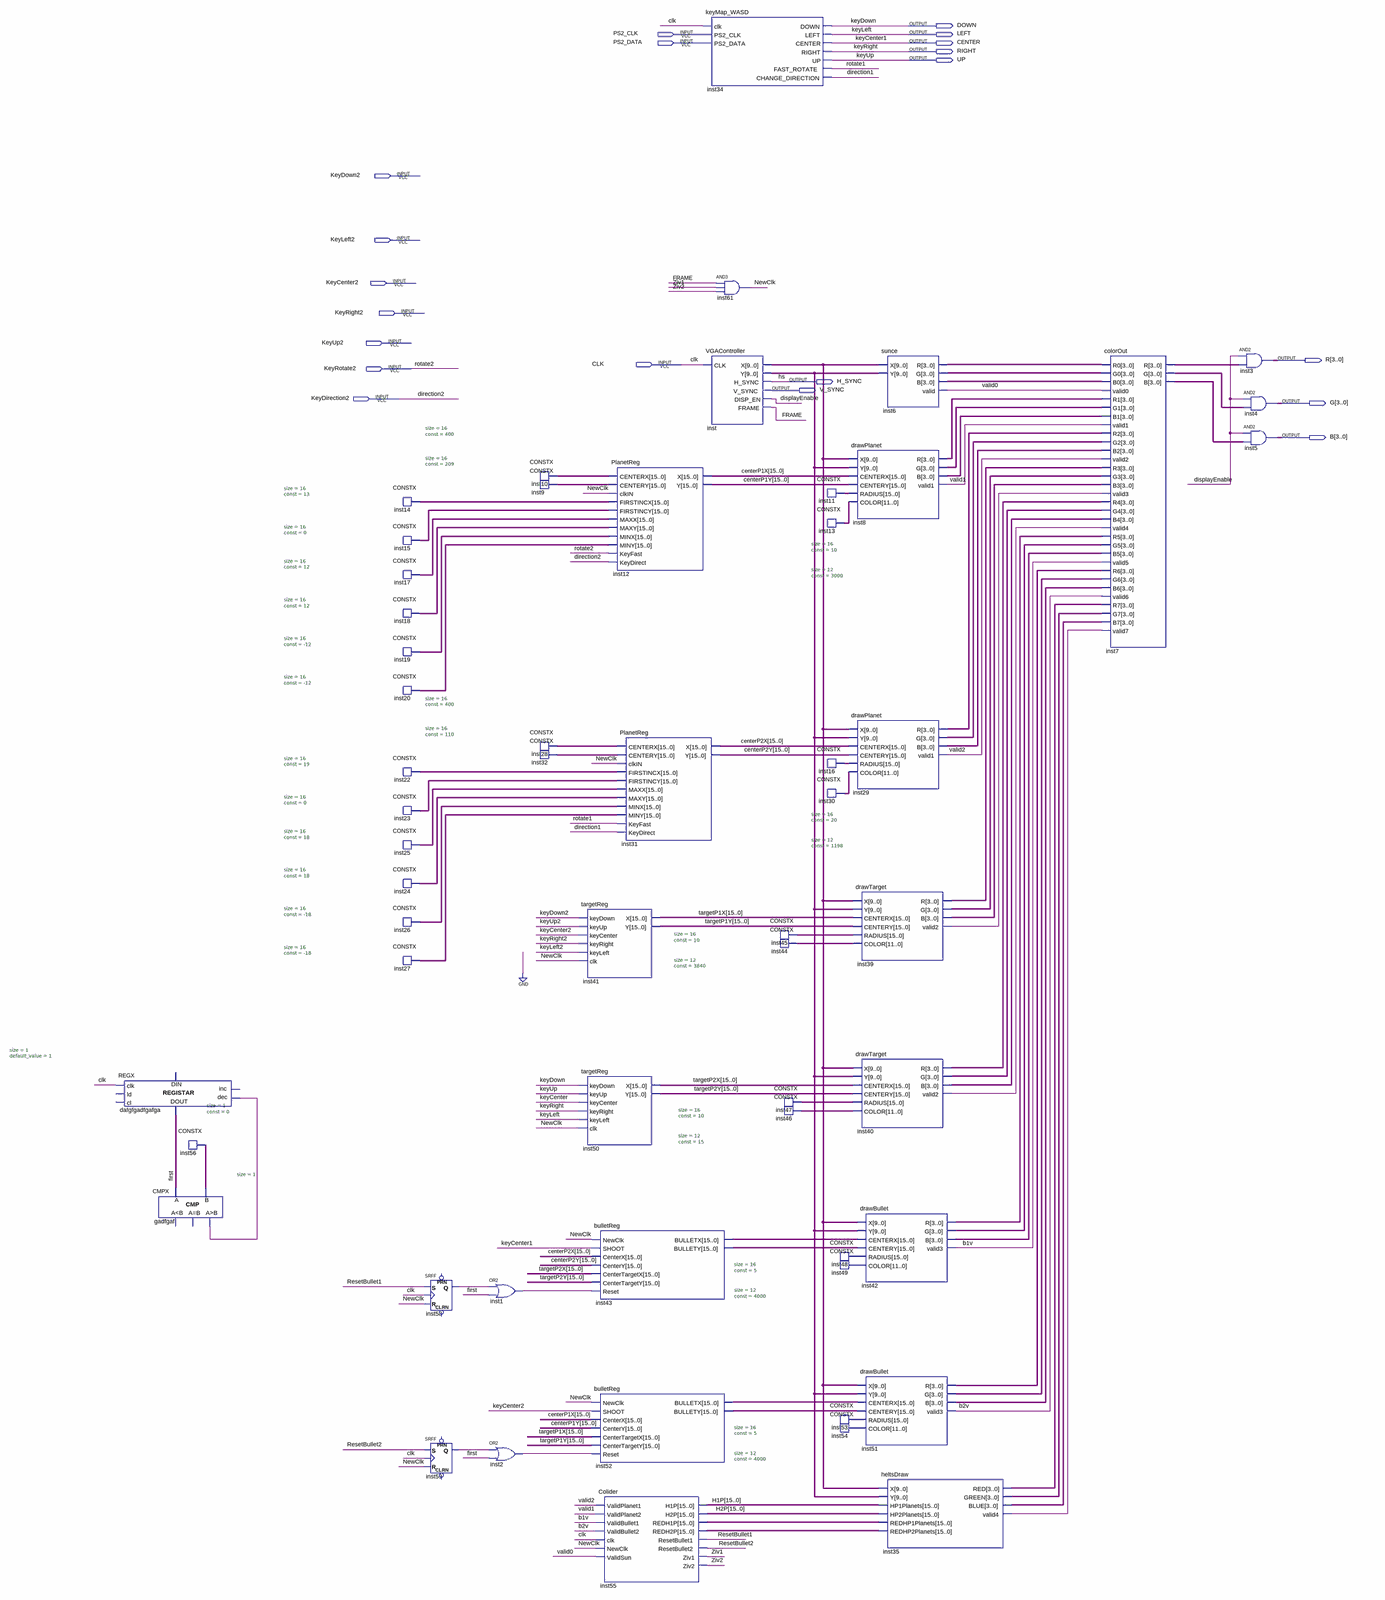
[diagram p0: schematic sheet, whole]
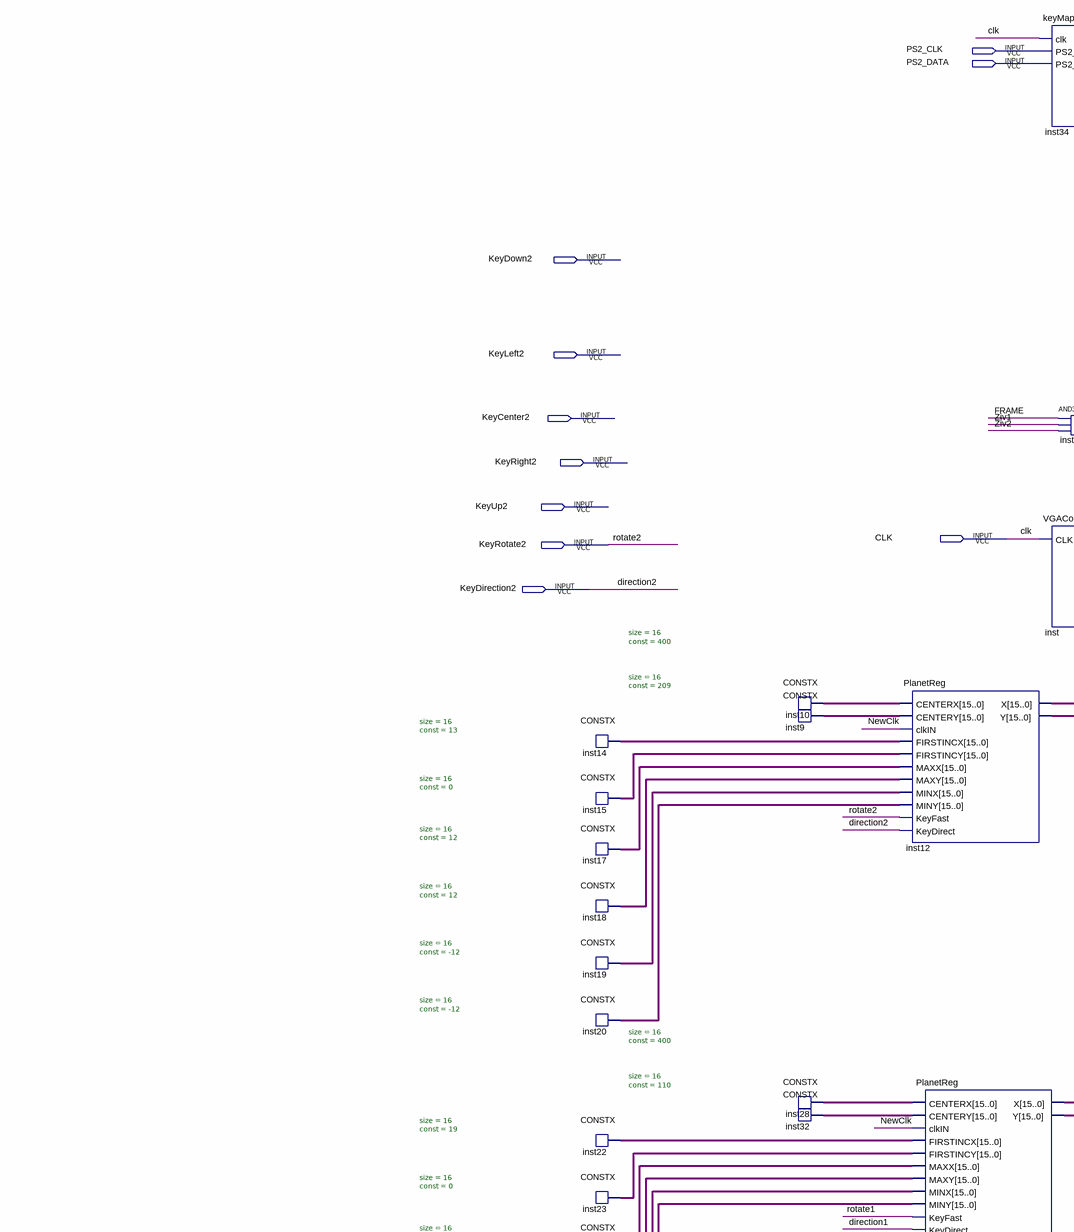
[diagram p1: schematic sheet, upper left part]
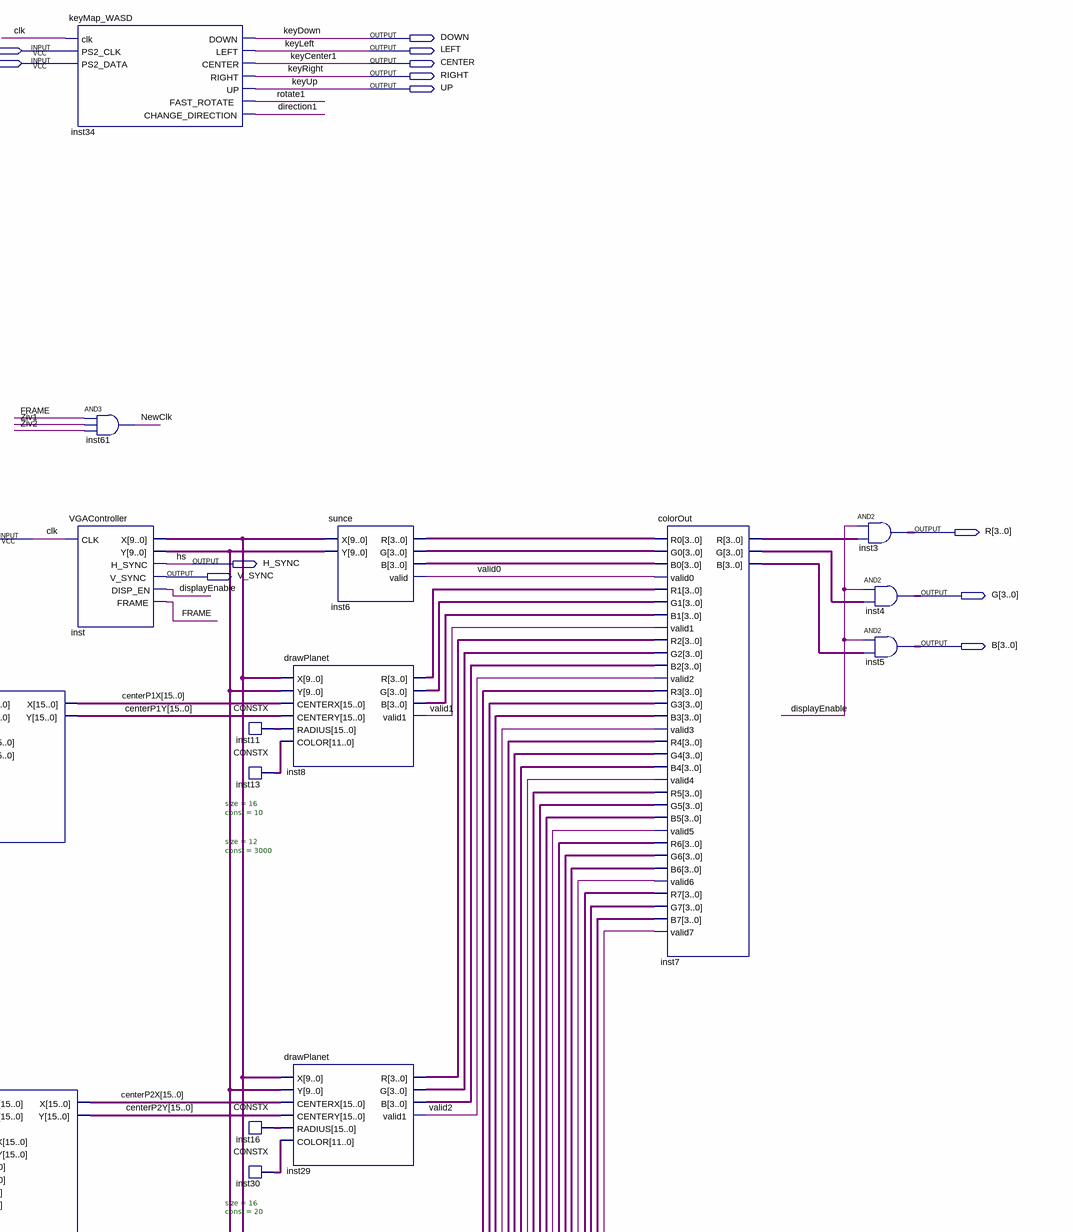
[diagram p2: schematic sheet, upper right part]
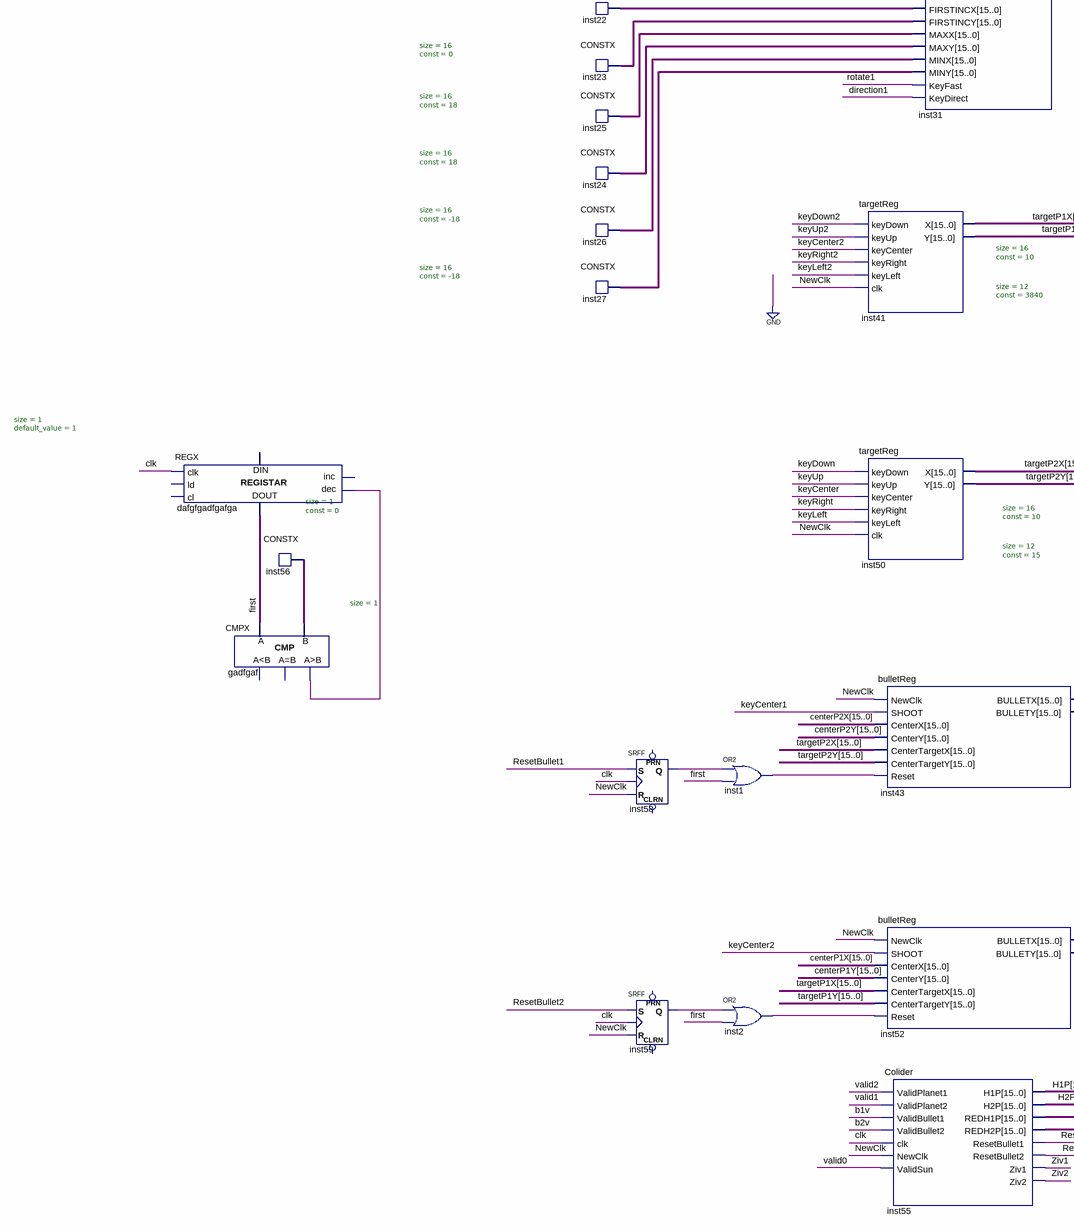
[diagram p3: schematic sheet, lower left part]
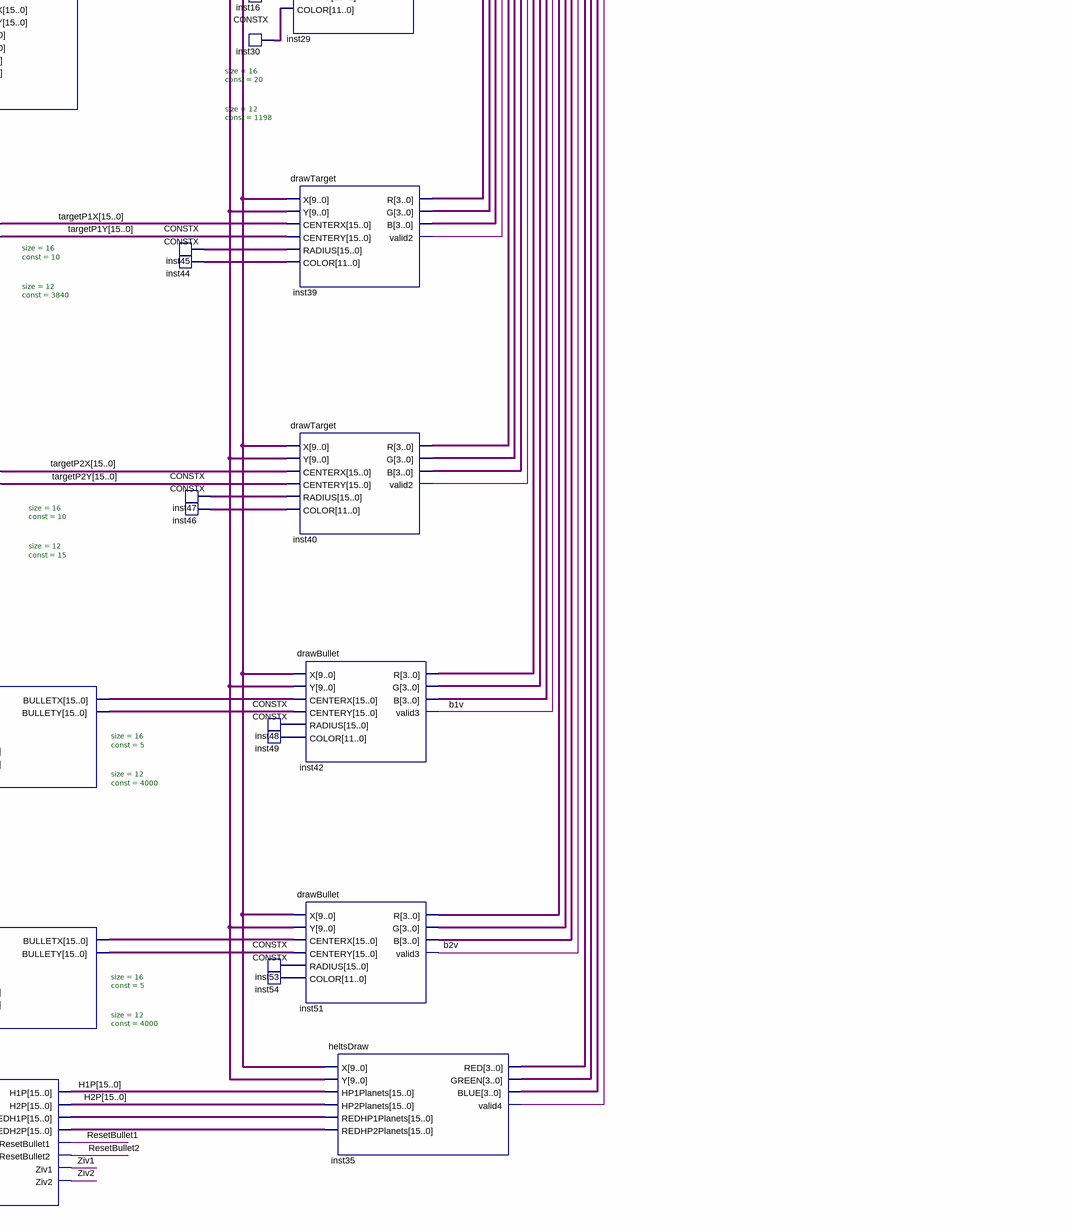
[diagram p4: schematic sheet, lower right part]
// Quartus schematic main.bdf as structural Verilog: 57 symbols, 20 pins
module main (
  input  PS2_CLK,
  input  PS2_DATA,
  input  KeyDown2,
  input  KeyLeft2,
  input  KeyCenter2,
  input  KeyRight2,
  input  KeyUp2,
  input  CLK,
  input  KeyRotate2,
  input  KeyDirection2,
  output DOWN,
  output LEFT,
  output CENTER,
  output RIGHT,
  output UP,
  output [3:0] R,
  output H_SYNC,
  output V_SYNC,
  output [3:0] G,
  output [3:0] B
);

  wire b1v, b2v, direction1, displayEnable, first, FRAME, gadfgaf_gr, inst1_out, inst2_out, inst35_valid4,
       inst39_valid2, inst40_valid2, inst56_data, inst58_q, inst59_q, keyCenter, NewClk, ResetBullet1,
       ResetBullet2, rotate1, valid0, valid1, valid2, Ziv1, Ziv2;
  wire [3:0] inst6_b, inst6_g, inst6_r, inst7_b, inst7_g, inst7_r, inst8_b, inst8_g, inst8_r, inst29_b,
       inst29_g, inst29_r, inst35_blue, inst35_green, inst35_red, inst39_b, inst39_g, inst39_r, inst40_b,
       inst40_g, inst40_r, inst42_b, inst42_g, inst42_r, inst51_b, inst51_g, inst51_r;
  wire [9:0] inst_x, inst_y;
  wire [11:0] inst13_data, inst30_data, inst44_data, inst46_data, inst49_data, inst54_data;
  wire [15:0] centerP1X, centerP1Y, centerP2X, centerP2Y, H1P, H2P, inst9_data, inst10_data, inst11_data,
       inst14_data, inst15_data, inst16_data, inst17_data, inst18_data, inst19_data, inst20_data,
       inst22_data, inst23_data, inst24_data, inst25_data, inst26_data, inst27_data, inst28_data,
       inst32_data, inst43_bulletx, inst43_bullety, inst45_data, inst47_data, inst48_data, inst52_bulletx,
       inst52_bullety, inst53_data, inst55_redh1p, inst55_redh2p, targetP1X, targetP1Y, targetP2X, targetP2Y;

  REGX #(.size(1), .default_value(1)) dafgfgadfgafga (
    .clk(CLK), .dec(gadfgaf_gr), .data_out(first));  // open: ld, cl, inc, data_in
  CMPX #(.size(1)) gadfgaf (.A(first), .B(inst56_data), .gr(gadfgaf_gr));  // open: ls, eq
  CONSTX #(.size(1), .\const (0)) inst56 (.data(inst56_data));
  CONSTX #(.size(16), .\const (13)) inst14 (.data(inst14_data));
  CONSTX #(.size(16), .\const (0)) inst15 (.data(inst15_data));
  CONSTX #(.size(16), .\const (12)) inst17 (.data(inst17_data));
  CONSTX #(.size(16), .\const (12)) inst18 (.data(inst18_data));
  CONSTX #(.size(16), .\const (-12)) inst19 (.data(inst19_data));
  CONSTX #(.size(16), .\const (-12)) inst20 (.data(inst20_data));
  CONSTX #(.size(16), .\const (19)) inst22 (.data(inst22_data));
  CONSTX #(.size(16), .\const (0)) inst23 (.data(inst23_data));
  CONSTX #(.size(16), .\const (18)) inst25 (.data(inst25_data));
  CONSTX #(.size(16), .\const (18)) inst24 (.data(inst24_data));
  CONSTX #(.size(16), .\const (-18)) inst26 (.data(inst26_data));
  CONSTX #(.size(16), .\const (-18)) inst27 (.data(inst27_data));
  SRFF inst58 (.S(ResetBullet1), .R(NewClk), .CLK(CLK), .Q(inst58_q));  // open: PRN, CLRN
  SRFF inst59 (.S(ResetBullet2), .R(NewClk), .CLK(CLK), .Q(inst59_q));  // open: PRN, CLRN
  or inst1 (inst1_out, inst58_q, first);
  or inst2 (inst2_out, inst59_q, first);
  CONSTX #(.size(16), .\const (400)) inst10 (.data(inst10_data));
  CONSTX #(.size(16), .\const (209)) inst9 (.data(inst9_data));
  CONSTX #(.size(16), .\const (400)) inst28 (.data(inst28_data));
  CONSTX #(.size(16), .\const (110)) inst32 (.data(inst32_data));
  targetReg inst41 (
    .keyDown(KeyDown2), .keyUp(KeyUp2), .keyCenter(KeyCenter2), .keyRight(KeyRight2), .keyLeft(KeyLeft2),
    .clk(NewClk), .X(targetP1X), .Y(targetP1Y));
  targetReg inst50 (
    .keyDown(DOWN), .keyUp(UP), .keyCenter(keyCenter), .keyRight(RIGHT), .keyLeft(LEFT), .clk(NewClk),
    .X(targetP2X), .Y(targetP2Y));
  bulletReg inst43 (
    .NewClk(NewClk), .SHOOT(CENTER), .CenterX(centerP2X), .CenterY(centerP2Y), .CenterTargetX(targetP2X),
    .CenterTargetY(targetP2Y), .Reset(inst1_out), .BULLETX(inst43_bulletx), .BULLETY(inst43_bullety));
  bulletReg inst52 (
    .NewClk(NewClk), .SHOOT(KeyCenter2), .CenterX(centerP1X), .CenterY(centerP1Y), .CenterTargetX(targetP1X),
    .CenterTargetY(targetP1Y), .Reset(inst2_out), .BULLETX(inst52_bulletx), .BULLETY(inst52_bullety));
  Colider inst55 (
    .ValidPlanet1(valid2), .ValidPlanet2(valid1), .ValidBullet1(b1v), .ValidBullet2(b2v), .clk(CLK),
    .NewClk(NewClk), .ValidSun(valid0), .H1P(H1P), .H2P(H2P), .REDH1P(inst55_redh1p), .REDH2P(inst55_redh2p),
    .ResetBullet1(ResetBullet1), .ResetBullet2(ResetBullet2), .Ziv1(Ziv1), .Ziv2(Ziv2));
  PlanetReg inst12 (
    .CENTERX(inst10_data), .CENTERY(inst9_data), .clkIN(NewClk), .FIRSTINCX(inst14_data),
    .FIRSTINCY(inst15_data), .MAXX(inst17_data), .MAXY(inst18_data), .MINX(inst19_data), .MINY(inst20_data),
    .KeyFast(KeyRotate2), .KeyDirect(KeyDirection2), .X(centerP1X), .Y(centerP1Y));
  PlanetReg inst31 (
    .CENTERX(inst28_data), .CENTERY(inst32_data), .clkIN(NewClk), .FIRSTINCX(inst22_data),
    .FIRSTINCY(inst23_data), .MAXX(inst25_data), .MAXY(inst24_data), .MINX(inst26_data), .MINY(inst27_data),
    .KeyFast(rotate1), .KeyDirect(direction1), .X(centerP2X), .Y(centerP2Y));
  keyMap_WASD inst34 (
    .clk(CLK), .PS2_CLK(PS2_CLK), .PS2_DATA(PS2_DATA), .DOWN(DOWN), .LEFT(LEFT), .CENTER(CENTER),
    .RIGHT(RIGHT), .UP(UP), .FAST_ROTATE(rotate1), .CHANGE_DIRECTION(direction1));
  VGAController inst (
    .CLK(CLK), .X(inst_x), .Y(inst_y), .H_SYNC(H_SYNC), .V_SYNC(V_SYNC), .DISP_EN(displayEnable),
    .FRAME(FRAME));
  and inst61 (NewClk, FRAME, Ziv1, Ziv2);
  CONSTX #(.size(16), .\const (10)) inst45 (.data(inst45_data));
  CONSTX #(.size(12), .\const (3840)) inst44 (.data(inst44_data));
  CONSTX #(.size(16), .\const (10)) inst47 (.data(inst47_data));
  CONSTX #(.size(12), .\const (15)) inst46 (.data(inst46_data));
  CONSTX #(.size(16), .\const (10)) inst11 (.data(inst11_data));
  CONSTX #(.size(12), .\const (3000)) inst13 (.data(inst13_data));
  CONSTX #(.size(16), .\const (20)) inst16 (.data(inst16_data));
  CONSTX #(.size(12), .\const (1198)) inst30 (.data(inst30_data));
  CONSTX #(.size(16), .\const (5)) inst48 (.data(inst48_data));
  CONSTX #(.size(12), .\const (4000)) inst49 (.data(inst49_data));
  CONSTX #(.size(16), .\const (5)) inst53 (.data(inst53_data));
  CONSTX #(.size(12), .\const (4000)) inst54 (.data(inst54_data));
  drawPlanet inst8 (
    .X(inst_x), .Y(inst_y), .CENTERX(centerP1X), .CENTERY(centerP1Y), .RADIUS(inst11_data),
    .COLOR(inst13_data), .R(inst8_r), .G(inst8_g), .B(inst8_b), .valid1(valid1));
  drawPlanet inst29 (
    .X(inst_x), .Y(inst_y), .CENTERX(centerP2X), .CENTERY(centerP2Y), .RADIUS(inst16_data),
    .COLOR(inst30_data), .R(inst29_r), .G(inst29_g), .B(inst29_b), .valid1(valid2));
  drawTarget inst39 (
    .X(inst_x), .Y(inst_y), .CENTERX(targetP1X), .CENTERY(targetP1Y), .RADIUS(inst45_data),
    .COLOR(inst44_data), .R(inst39_r), .G(inst39_g), .B(inst39_b), .valid2(inst39_valid2));
  drawTarget inst40 (
    .X(inst_x), .Y(inst_y), .CENTERX(targetP2X), .CENTERY(targetP2Y), .RADIUS(inst47_data),
    .COLOR(inst46_data), .R(inst40_r), .G(inst40_g), .B(inst40_b), .valid2(inst40_valid2));
  drawBullet inst42 (
    .X(inst_x), .Y(inst_y), .CENTERX(inst43_bulletx), .CENTERY(inst43_bullety), .RADIUS(inst48_data),
    .COLOR(inst49_data), .R(inst42_r), .G(inst42_g), .B(inst42_b), .valid3(b1v));
  drawBullet inst51 (
    .X(inst_x), .Y(inst_y), .CENTERX(inst52_bulletx), .CENTERY(inst52_bullety), .RADIUS(inst53_data),
    .COLOR(inst54_data), .R(inst51_r), .G(inst51_g), .B(inst51_b), .valid3(b2v));
  sunce inst6 (.X(inst_x), .Y(inst_y), .R(inst6_r), .G(inst6_g), .B(inst6_b), .valid(valid0));
  heltsDraw inst35 (
    .X(inst_x), .Y(inst_y), .HP1Planets(H1P), .HP2Planets(H2P), .REDHP1Planets(inst55_redh1p),
    .REDHP2Planets(inst55_redh2p), .RED(inst35_red), .GREEN(inst35_green), .BLUE(inst35_blue),
    .valid4(inst35_valid4));
  colorOut inst7 (
    .R0(inst6_r), .G0(inst6_g), .B0(inst6_b), .valid0(valid0), .R1(inst8_r), .G1(inst8_g), .B1(inst8_b),
    .valid1(valid1), .R2(inst29_r), .G2(inst29_g), .B2(inst29_b), .valid2(valid2), .R3(inst39_r),
    .G3(inst39_g), .B3(inst39_b), .valid3(inst39_valid2), .R4(inst40_r), .G4(inst40_g), .B4(inst40_b),
    .valid4(inst40_valid2), .R5(inst42_r), .G5(inst42_g), .B5(inst42_b), .valid5(b1v), .R6(inst51_r),
    .G6(inst51_g), .B6(inst51_b), .valid6(b2v), .R7(inst35_red), .G7(inst35_green), .B7(inst35_blue),
    .valid7(inst35_valid4), .R(inst7_r), .G(inst7_g), .B(inst7_b));
  assign R = {4{displayEnable}} & inst7_r;  // AND2 inst3, 4 bits wide
  assign G = {4{displayEnable}} & inst7_g;  // AND2 inst4, 4 bits wide
  assign B = {4{displayEnable}} & inst7_b;  // AND2 inst5, 4 bits wide

  // Other names for the same wires on the sheet: direction2 = KeyDirection2; hs = H_SYNC; keyCenter1 = CENTER;
  //   keyDown = DOWN; keyLeft = LEFT; keyRight = RIGHT; keyUp = UP; rotate2 = KeyRotate2
endmodule
